# Altium schematic sheet IN_conditioning.SchDoc: Modulator v1.0
size 420 x 297 mm; Author: shanasz; CompanyName: WUT; DrawnBy: shanasz; Organization: WUT ISE; Address1: Warsaw Univeristy of Technology; Address2: Nowowiejska 15/19; DocumentNumber: 5; Revision: -; SheetNumber: 5; SheetTotal: 6; EDA_Number: ARTIQ; Projet: ARTIQ/SINARA; ModifiedBy: -; CreateDate: XX/XX/XXXX; CheckedDate: -; Title2: Input signal conditioning; DivGrp: ISE; Designer: shanasz; ModifiedDate: -; ProjectName: ARTIQ/SINARA
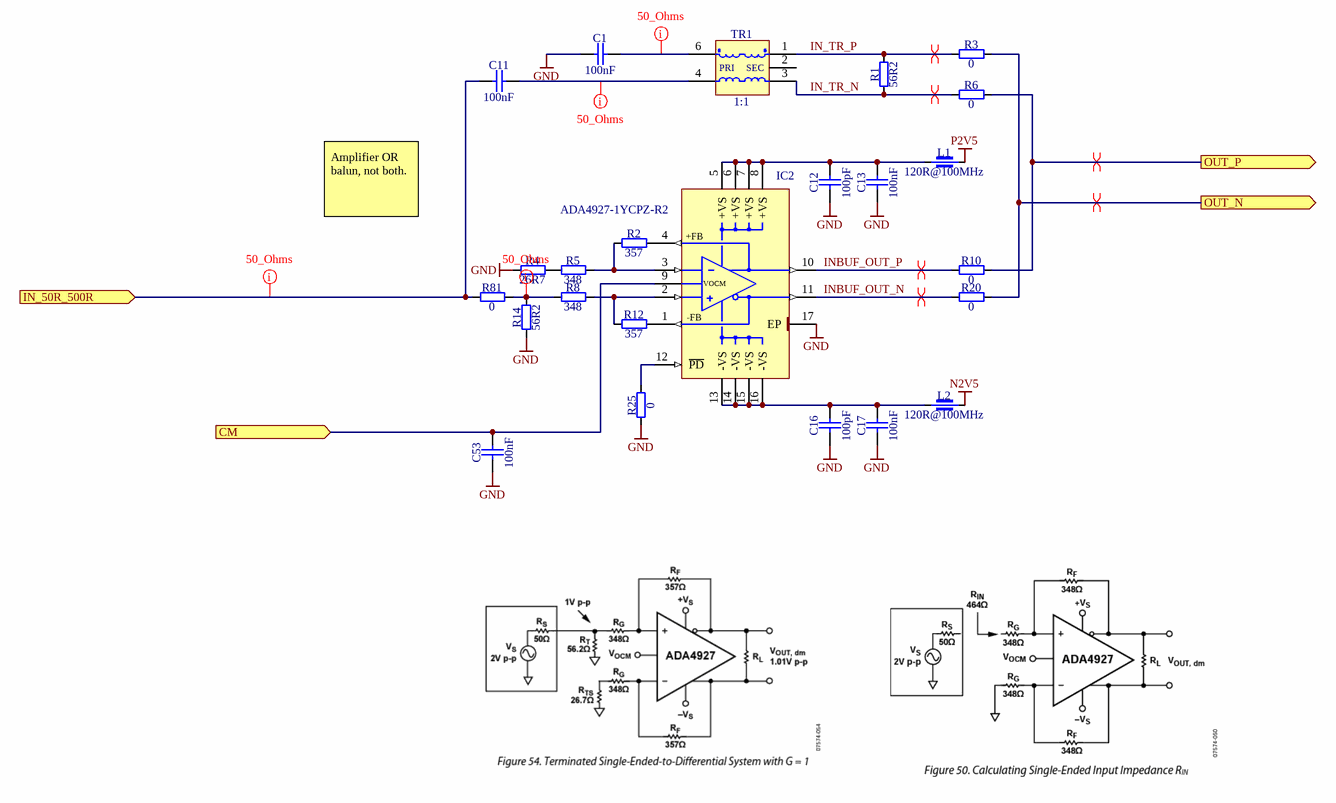
[diagram p0: IN_conditioning.SchDoc]

## Parts
C1  100nF  [CAPC1005X55N]
C11  100nF  [CAPC1005X55N]
C12  100pF  [CAPC1005X55N]
C13  100nF  [CAPC1005X55N]
C16  100pF  [CAPC1005X55N]
C17  100nF  [CAPC1005X55N]
C53  100nF  [CAPC1005X55N]
IC2  ADA4927-1YCPZ-R2  [QFN50P300X300X100-17N-S145]
L1  120R@100MHz  [INDC1005X55N]
L2  120R@100MHz  [INDC1005X55N]
R1  56R2  [RESC1005X40N]
R2  357  [RESC1005X40N]
R3  0  [RESC1005X40N]
R4  26R7  [RESC1005X40N]
R5  348  [RESC1005X40N]
R6  0  [RESC1005X40N]
R8  348  [RESC1005X40N]
R10  0  [RESC1005X40N]
R12  357  [RESC1005X40N]
R14  56R2  [RESC1005X40N]
R20  0  [RESC1005X40N]
R25  0  [RESC1005X40N]
R81  0  [RESC1005X40N]
TR1  1:1  [XFMR_MINI-CIRCUITS_AT224]

## Ports
CM (in), IN_50R_500R (in), OUT_N (out), OUT_P (out)

## Nets
GND: C1.1 C12.1 C13.1 C16.1 C17.1 C53.1 IC2.17(EP) R4.1 R14.1 R25.1
N2V5: L2.2
P2V5: L1.2
CM: C53.2 IC2.9(VOCM) ; port CM
IN_50R_500R: C11.1 R81.1 ; port IN_50R_500R
IN_TR_N: R1.1 R6.1 TR1.3(S)
IN_TR_P: R1.2 R3.1 TR1.1(SDOT)
INBUF_OUT_N: IC2.11(-OUT) R20.1
INBUF_OUT_P: IC2.10(+OUT) R10.1
OUT_N: R3.2 R20.2 ; port OUT_N
OUT_P: R6.2 R10.2 ; port OUT_P
NetC1_2: C1.2 TR1.6(PDOT)
NetC11_2: C11.2 TR1.4(P)
NetC12_2: C12.2 C13.2 IC2.5(+VS) IC2.6(+VS) IC2.7(+VS) IC2.8(+VS) L1.1
NetC16_2: C16.2 C17.2 IC2.13(-VS) IC2.14(-VS) IC2.15(-VS) IC2.16(-VS) L2.1
NetIC2_1: IC2.1(-FB) R12.2
NetIC2_2: IC2.2(+IN) R8.2 R12.1
NetIC2_3: IC2.3(-IN) R2.1 R5.2
NetIC2_4: IC2.4(+FB) R2.2
NetIC2_12: IC2.12(~{PD}) R25.2
NetR4_2: R4.2 R5.1
NetR8_1: R8.1 R14.2 R81.2

Not connected (* = marked no-connect by the designer): TR1 2(NC)

## Layout directives
net class 50_Ohms: IN_50R_500R, NetC1_2, NetC11_2, NetR8_1
differential pair: IN_TR_N, IN_TR_P, INBUF_OUT_N, INBUF_OUT_P, OUT_N, OUT_P

## Notes on the sheet
- Amplifier OR balun, not both.
- Project/Equipment
- Document
- Designer
- Drawn by
- Check.by
- File
- Last Mod.
- Print Date
- Sheet
- Size
- A3
- of
- Rev
- (in symbol XFMR_MINI-CIRCUITS_TC1-1-13M+) PRI; SEC

## Library data of the parts
C1 C11 C13 C17 C53 = CC0402_100NF_16V_10%_X5R: Non-polarised capacitor; Part Description: SMD Multilayer Chip Ceramic Capacitor; Manufacturer: GENERIC; Manufacturer1 Part Number: GRM155R61C104KA88D; Voltage: 16V; TC: X5R; Tolerance: ±10%; Part Number: CC0402_100NF_16V_10%_X5R; Component Kind: Standard; Component Type: Standard; Pin Count: 2; Value: 100nF; Status: None; Manufacturer Part Number: CC0402_100NF_16V_10%_X5R; Case: 0402; Mounted: Yes; Socket: No; SMD: Yes; Sense: No; Manufacturer1 Example: MURATA; Manufacturer1 ComponentHeight: 0.55mm; HelpURL: \\cern.ch\dfs\Applications\Altium\Datasheets\CC0402_X5R_MURATA_GRM.pdf; Author: CERN DEM JLC; CreateDate: 10.12.2013; LatestRevisionDate: 10.12.2013
C12 C16 = CC0402_100PF_50V_2%_C0G: Non-polarised capacitor; Part Description: SMD Multilayer Chip Ceramic Capacitor; Manufacturer: GENERIC; Manufacturer Part Number: CC0402_100PF_50V_5%_C0G; Manufacturer1 Part Number: C0402C101G5GAC; Voltage: 50V; TC: C0G/NP0; Tolerance: ±2%; Part Number: CC0402_100PF_50V_2%_C0G; Component Kind: Standard; Component Type: Standard; Pin Count: 2; Value: 100pF; Status: Preferred; Case: 0402; Mounted: Yes; Socket: No; SMD: Yes; Sense: No; Manufacturer1 Example: KEMET; Manufacturer1 ComponentHeight: 0.55mm; HelpURL: \\cern.ch\dfs\Applications\Altium\Datasheets\CC0402_C0G_KEMET_(Commercial Grade).pdf; Author: CERN DEM BC; CreateDate: 15.06.2020; LatestRevisionDate: 15.06.2020
IC2 = ADA4927-1YCPZ-R2: Ultralow Distortion Current Feedback Differential ADC Driver; Manufacturer: ANALOG DEVICES; PressFit: No; Bonding: No; Part Number: ADA4927-1YCPZ-R2; Component Kind: Standard; Component Type: Standard; Device: ADA4927-1YCPZ-R2; PackageDescription: QFN, 0.50mm pitch, Square; 16 Pin, 3.00mm L X 3.00mm W X 1.00mm H body (w/Thermal Tab 1.45 X 1.45mm), IPC Medium Density; Part Description: Ultralow Distortion Current Feedback Differential ADC Driver; Manufacturer Part Number: ADA4927-1YCP; Pin Count: 17; Case: QFN16; Mounted: Yes; Socket: No; SMD: Yes; Sense: No; ComponentHeight: 1mm; Author: CERN DEM JLC; HelpURL: \\cern.ch\dfs\Applications\Altium\Datasheets\ADA4927-1YCPZ-R2.pdf; CreateDate: 19.04.2010; LatestRevisionDate: 31.03.2022
L1 L2 = IND0402_MURATA_BLM15PX121SN1D: Part Description: SMD EMIFIL Chip Ferrite Bead; Manufacturer: MURATA; Power: 2A; Resistance: 0.055R; Tolerance: ±25%; Part Number: IND0402_MURATA_BLM15PX121SN1D; Component Kind: Standard; Component Type: Standard; Pin Count: 2; Value: 120R@100MHz; Manufacturer Part Number: BLM15PX121SN1D; Case: 0402; Mounted: Yes; Socket: No; SMD: Yes; Sense: No; ComponentHeight: 0.55mm; HelpURL: \\cern.ch\dfs\Applications\Altium\Datasheets\IND0402_MURATA_BLM15PX.pdf; Author: CERN DEM JMW; CreateDate: 19.02.2014; LatestRevisionDate: 25.10.2018
R1 R14 = R0402_56R2_1%_0.063W_50PPM: Resistor - 1%; Part Description: Thin Film Chip Resistor; Manufacturer: GENERIC; Manufacturer1 Part Number: CRT0402-FZ-56R2GLF; TC: ±50ppm; PressFit: No; Part Number: R0402_56R2_1%_0.063W_50PPM; Component Kind: Standard; Component Type: Standard; Pin Count: 2; Value: 56R2; Status: Not Recommended; Manufacturer Part Number: R0402_56R2_1%_0.063W_50PPM; Case: 0402; Mounted: Yes; Sense: No; Socket: No; SMD: Yes; Manufacturer1 Example: Bourns; Author: SHA
R2 R12 = R0402_357R_0.1%_0.063W_50PPM: Resistor - 0.1%; Part Number: R0402_357R_0.1%_0.063W_25PPM; Part Description: Thin Film Chip Resistor; Manufacturer: GENERIC; Manufacturer1 Part Number: 1879214-5; TC: ±50ppm; PressFit: No; Component Kind: Standard; Component Type: Standard; Pin Count: 2; Value: 357; Status: Not Recommended; Manufacturer Part Number: R0402_357R_0.1%_0.063W_50PPM; Case: 0402; Mounted: Yes; Sense: No; Socket: No; SMD: Yes; Manufacturer1 Example: TE Connectivity / Amp; Author: SHA
R3 R6 R10 R20 R25 R81 = R0402_0R_JUMPER: Resistor; Part Description: 1A (0.05R Max DC Resistance) Zero Ohm Jumper; Manufacturer: GENERIC; Manufacturer1 Part Number: 232270591001L; PressFit: No; Part Number: R0402_0R_JUMPER; Component Kind: Standard; Component Type: Standard; Pin Count: 2; Value: 0; Status: Not Recommended; Manufacturer Part Number: R0402_0R_JUMPER; Case: 0402; Mounted: Yes; Sense: No; Socket: No; SMD: Yes; Manufacturer1 Example: YAGEO PHYCOMP; Manufacturer1 ComponentHeight: 0.4mm; HelpURL: \\cern.ch\dfs\Applications\Altium\Datasheets\R0402_Phycomp_RC0402.pdf; Author: CERN DEM JLC; CreateDate: 03.12.2007; LatestRevisionDate: 17.10.2012
R4 = R0402_26R7_1%_0.063W_100PPM: Resistor - 1%; Part Description: Thin Film Chip Resistor; Manufacturer: GENERIC; Manufacturer Part Number: R0402_26R7_0.1%_0.063W_25PPM; Manufacturer1 Part Number: CRCW040226R7FKED; TC: ±100ppm; PressFit: No; Part Number: R0402_26R7_1%_0.063W_100PPM; Component Kind: Standard; Component Type: Standard; Pin Count: 2; Value: 26R7; Status: Not Recommended; Case: 0402; Mounted: Yes; Sense: No; Socket: No; SMD: Yes; Manufacturer1 Example: Vishay / Dale; Author: SHA
R5 R8 = R0402_348R_0.1%_0.063W_25PPM: Resistor - 0.1%; Part Description: Thin Film Chip Resistor; Manufacturer: GENERIC; Manufacturer1 Part Number: RT0402BRD07348RL; TC: ±25ppm; PressFit: No; Part Number: R0402_348R_0.1%_0.063W_25PPM; Component Kind: Standard; Component Type: Standard; Pin Count: 2; Value: 348; Status: Not Recommended; Manufacturer Part Number: R0402_348R_0.1%_0.063W_25PPM; Case: 0402; Mounted: Yes; Sense: No; Socket: No; SMD: Yes; Manufacturer1 Example: YAGEO; Author: SHA
TR1 = XFMR_MINI-CIRCUITS_TC1-1-13M+: 50 Ohms 4.5 To 3000MHz RF Transformers; Part Number: XFMR_MINI-CIRCUITS_TC1-1-13M+; Component Kind: Standard; Component Type: Standard; Pin Count: 5; Value: 1:1; Status: None; Part Description: 50 Ohms 4.5 to 3000MHz RF Transformer; Manufacturer: MINI-CIRCUITS; Manufacturer Part Number: TC1-1-13M+; Mounted: Yes; Socket: No; Sense: No; SMD: Yes; ComponentHeight: 3.81mm; HelpURL: \\cern.ch\dfs\Applications\Altium\Datasheets\XFMR_MINI-CIRCUITS_TC1-1-13M+.pdf; Author: CERN DEM JLC; CreateDate: 30.11.2011; LatestRevisionDate: 30.11.2011